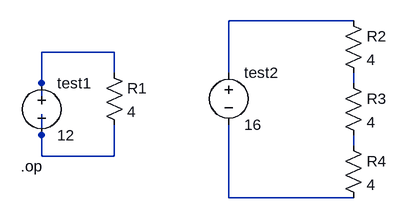
[diagram p0: schematic circuit.asc]
circuit.asc, the LTspice schematic file:
Version 4.1
SHEET 1 880 680
WIRE 304 -256 112 -256
WIRE -64 -208 -176 -208
WIRE -64 -176 -64 -208
WIRE 112 -176 112 -256
WIRE -176 -160 -176 -208
WIRE 304 -160 304 -176
WIRE -176 -128 -176 -160
WIRE -176 -80 -176 -112
WIRE 304 -64 304 -80
WIRE -176 -48 -176 -80
WIRE -64 -48 -64 -96
WIRE -64 -48 -176 -48
WIRE 112 16 112 -96
WIRE 304 16 112 16
SYMBOL res -80 -192 R0
SYMATTR InstName R1
SYMATTR Value 4
SYMBOL voltage -176 -176 R0
WINDOW 123 0 0 Left 0
WINDOW 39 0 0 Left 0
SYMATTR InstName test1
SYMATTR Value 12
SYMBOL voltage 112 -192 R0
SYMATTR InstName test2
SYMATTR Value 16
SYMBOL res 288 -272 R0
SYMATTR InstName R2
SYMATTR Value 4
SYMBOL res 288 -176 R0
SYMATTR InstName R3
SYMATTR Value 4
SYMBOL res 288 -80 R0
SYMATTR InstName R4
SYMATTR Value 4
TEXT -208 -32 Left 2 !.op

The netlist it stands for:
* circuit.asc
R1 N002 N004 4
V§test1 N002 N004 12
V§test2 N001 N006 16
R2 N001 N003 4
R3 N003 N005 4
R4 N005 N006 4
.op
.backanno
.end